# EAGLE design Cool-unitV2 (EAGLE 8.4.2)
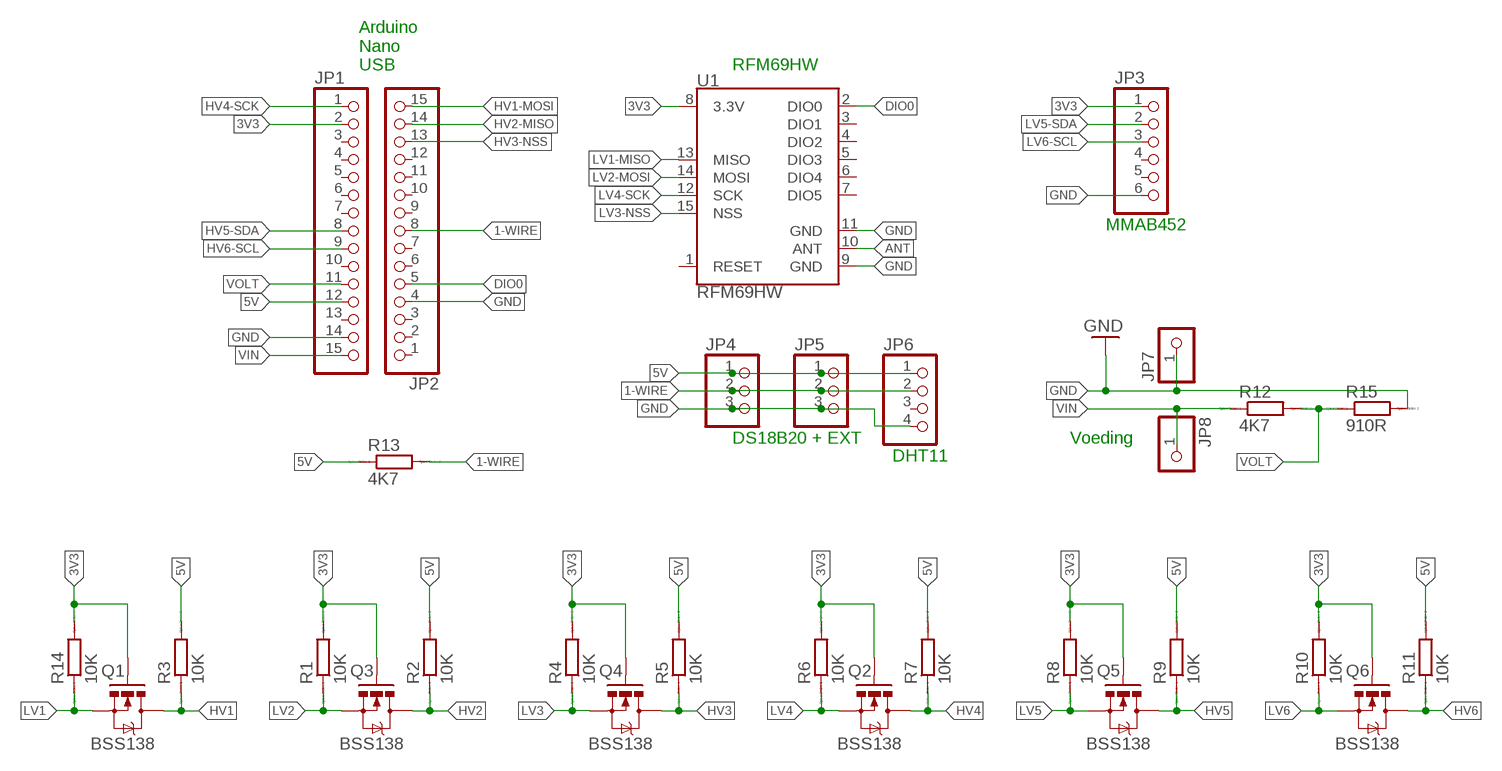
[diagram p0: schematic, sheet 1]

## Parts
JP1  PINHD-1X15  [1X15]
JP2  PINHD-1X15  [1X15]
JP3  PINHD-1X6  [1X06]
JP4  PINHD-1X3  [1X03]
JP5  PINHD-1X3  [1X03]
JP6  PINHD-1X4  [1X04]
JP7  PINHD-1X1  [1X01]
JP8  PINHD-1X1  [1X01]
Q1  BSS138  MOSFET-NCHANNELSMD  [SOT23-3]
Q2  BSS138  MOSFET-NCHANNELSMD  [SOT23-3]
Q3  BSS138  MOSFET-NCHANNELSMD  [SOT23-3]
Q4  BSS138  MOSFET-NCHANNELSMD  [SOT23-3]
Q5  BSS138  MOSFET-NCHANNELSMD  [SOT23-3]
Q6  BSS138  MOSFET-NCHANNELSMD  [SOT23-3]
R1  10K  RR3216  [R3216]
R2  10K  RR3216  [R3216]
R3  10K  RR3216  [R3216]
R4  10K  RR3216  [R3216]
R5  10K  RR3216  [R3216]
R6  10K  RR3216  [R3216]
R7  10K  RR3216  [R3216]
R8  10K  RR3216  [R3216]
R9  10K  RR3216  [R3216]
R10  10K  RR3216  [R3216]
R11  10K  RR3216  [R3216]
R12  4K7  RR3216  [R3216]
R13  4K7  RR3216  [R3216]
R14  10K  RR3216  [R3216]
R15  910R  RR3216  [R3216]
U1  RFM69HW  [RFM69W-XXXS2]

## Nets
1-WIRE: JP2.8 JP4.2 JP5.2 JP6.2 R13.2
3V3: JP1.2 JP3.1 Q1.1(G) Q2.1(G) Q3.1(G) Q4.1(G) Q5.1(G) Q6.1(G) R1.2 R4.2 R6.2 R8.2 R10.2 R14.2 U1.8(3.3V)
5V: JP1.12 JP4.1 JP5.1 JP6.1 R2.2 R3.2 R5.2 R7.2 R9.2 R11.2 R13.1
ANT: U1.10(ANT)
DIO0: JP2.5 U1.2(DIO0)
GND: JP1.14 JP2.4 JP3.6 JP4.3 JP5.3 JP6.4 JP7.1 R15.2 U1.9(GND) U1.11(GND)
HV1: JP2.15 Q1.3(D) R3.1
HV2: JP2.14 Q3.3(D) R2.1
HV3: JP2.13 Q4.3(D) R5.1
HV4: JP1.1 Q2.3(D) R7.1
HV5: JP1.8 Q5.3(D) R9.1
HV6: JP1.9 Q6.3(D) R11.1
LV1: Q1.2(S) R14.1 U1.13(MISO)
LV2: Q3.2(S) R1.1 U1.14(MOSI)
LV3: Q4.2(S) R4.1 U1.15(NSS)
LV4: Q2.2(S) R6.1 U1.12(SCK)
LV5: JP3.2 Q5.2(S) R8.1
LV6: JP3.3 Q6.2(S) R10.1
VIN: JP1.15 JP8.1 R12.1
VOLT: JP1.11 R12.2 R15.1
Unconnected: JP1.3 JP1.4 JP1.5 JP1.6 JP1.7 JP1.10 JP1.13 JP2.1 JP2.2 JP2.3 JP2.6 JP2.7 JP2.9 JP2.10 JP2.11 JP2.12 JP3.4 JP3.5 JP6.3 U1.1(RESET) U1.3(DIO1) U1.4(DIO2) U1.5(DIO3) U1.6(DIO4) U1.7(DIO5)

## Notes on the sheet
- Arduino
  Nano
  USB
- RFM69HW
- MMAB452
- DS18B20 + EXT | Voeding
- DHT11

## Library data of the parts
JP1 JP2 = pinhead:PINHD-1X15: PIN HEADER
JP3 = pinhead:PINHD-1X6: PIN HEADER
JP4 JP5 = pinhead:PINHD-1X3: PIN HEADER
JP6 = pinhead:PINHD-1X4: PIN HEADER
JP7 JP8 = pinhead:PINHD-1X1: PIN HEADER
Q1-Q6 = SparkFun:MOSFET-NCHANNEL
R1-R15 = eagle-ltspice:R: RESISTOR, European symbol; SPICEMODEL: NONE; SPICEPREFIX: R
U1 = SparkFun-RF:RFM69H: Hope RF RFM69H ISM Transceiver Module The RFM69H is a transceiver module capable of operation over a wide frequency range, including the 315,433,868 and 915MHz license-free ISM (Industry Scientific and Medical) frequency bands. All major RF communication parameters are programmable and most of them can be dynamically set. The RFM69H offers the unique advantage of programmable narrow-band and wide- band communication modes. The RFM69H is optimized for low power consumption while offering high RF output power and channelized operation.Compliance ETSI and FCC regulations. Datasheet <http://www.hoperf.cn/upload/docs/RF/SX/RFM69H_DataSheet_v1.3.pdf> SparkFun Products RFM69HCW Wireless Transceiver - 915MHz <https://www.sparkfun.com/products/13909> (COM-13909) RFM69HCW Wireless Transceiver - 434MHz <https://www.sparkfun.com/products/13910> (COM-13910) SparkFun RFM69 Breakout (915MHz) <https://www.sparkfun.com/products/12775> (WRL-12775) SparkFun RFM69 Breakout (434MHz) <https://www.sparkfun.com/products/12823> (WRL-12823)

## Board
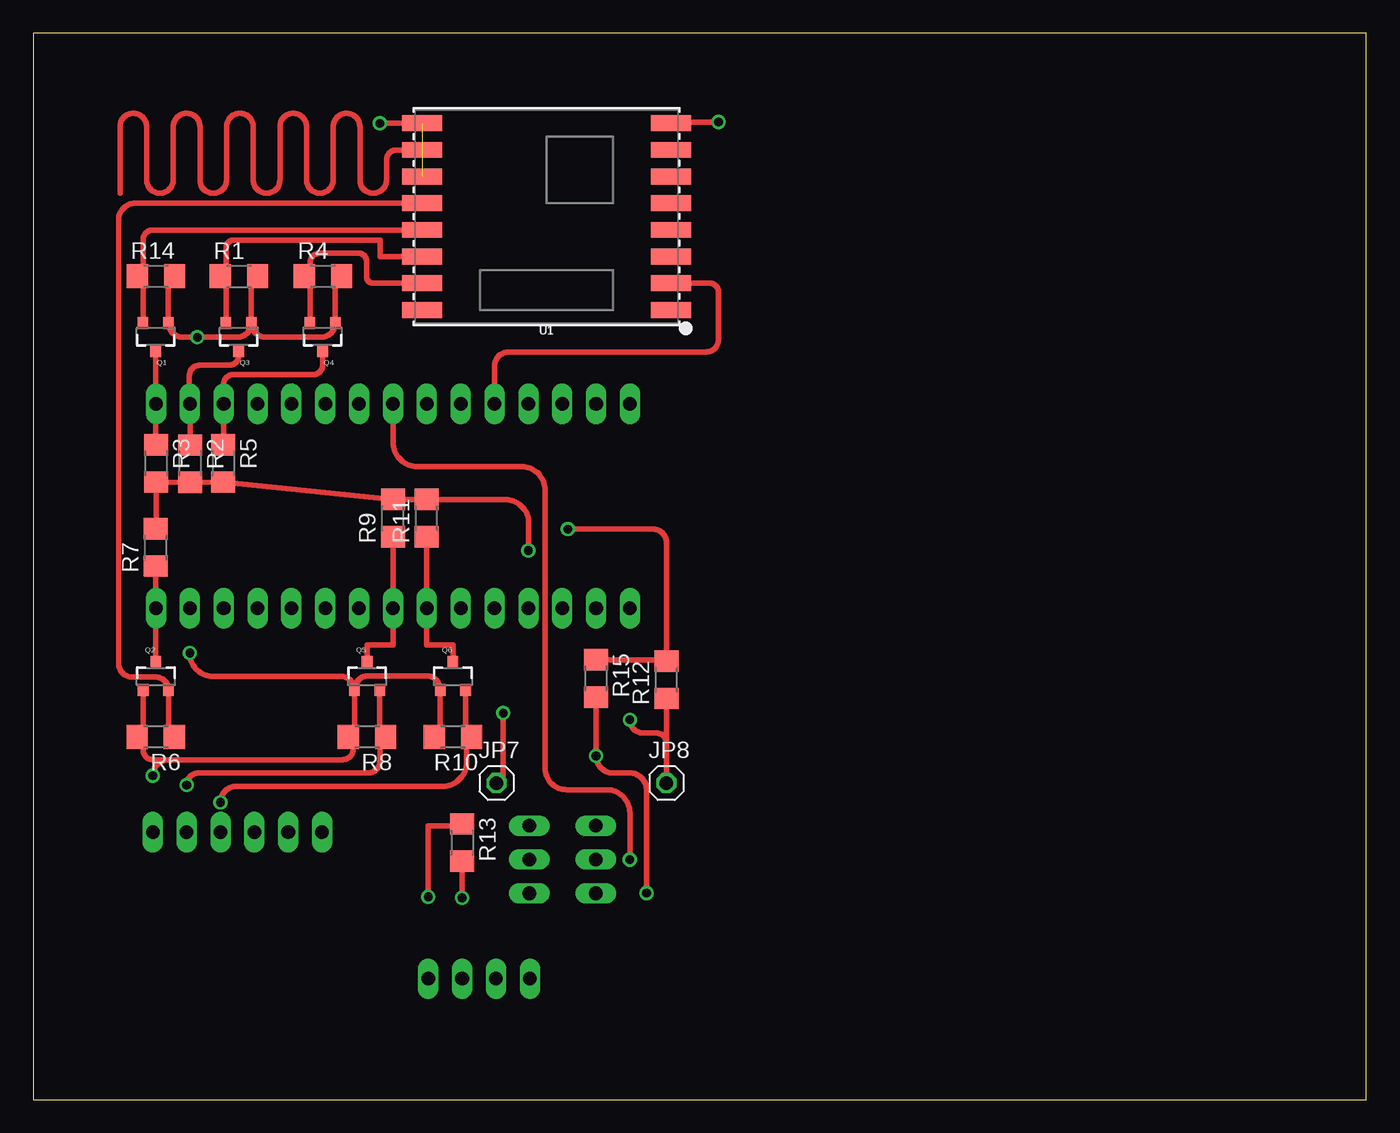
[diagram p1: board, top side]
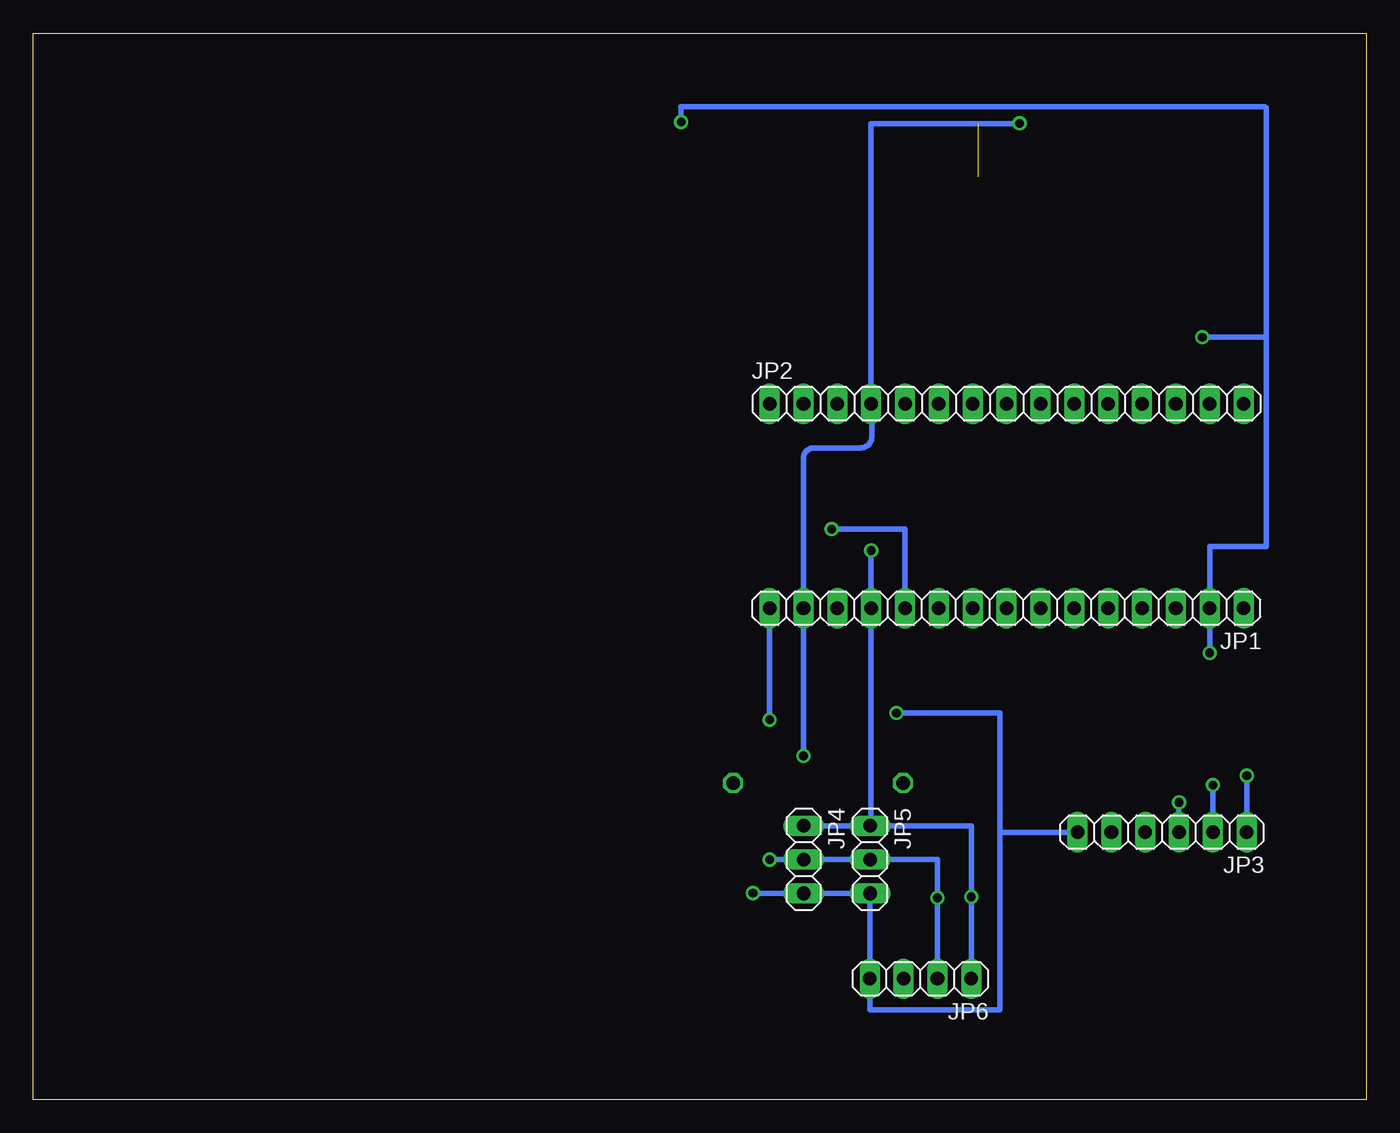
[diagram p2: board, bottom side, seen from below]

Size 100 x 80 mm. Coordinates in mm from the lower left corner, seen from the top.
Outline: 0,0 100,0 100,80 0,80 0,0
Copper layers (1*16): Top 0.035mm / dielectric 1.5mm / Bottom 0.035mm
Design rules "default": minimum track width 10mil, minimum drill 24mil, track to track 8mil, track to pad 8mil, pad to pad 8mil, via to via 8mil, smd to smd 8mil, copper to edge 40mil, drill to drill 8mil, minimum pad ring 10mil, minimum via ring 8mil, stop-mask expansion 4mil, vias tented up to drill 0mil, thermal gap 10mil

### Footprints (pad centres in the part's own frame; a part is rotated, then mirrored left to right if it is on the bottom)
1X15 = drill 1.016 long: 1 -17.78,0; 2 -15.24,0; 3 -12.7,0; 4 -10.16,0; 5 -7.62,0; 6 -5.08,0; 7 -2.54,0; 8 0,0; 9 2.54,0; 10 5.08,0; 11 7.62,0; 12 10.16,0; 13 12.7,0; 14 15.24,0; 15 17.78,0
1X06 = drill 1.016 long: 1 -6.35,0; 2 -3.81,0; 3 -1.27,0; 4 1.27,0; 5 3.81,0; 6 6.35,0
1X03 = drill 1.016 long: 1 -2.54,0; 2 0,0; 3 2.54,0
1X04 = drill 1.016 long: 1 -3.81,0; 2 -1.27,0; 3 1.27,0; 4 3.81,0
1X01 = drill 1.016 octagon: 1 0,0
SOT23-3 = smd 0.8 x 0.9: 1 -0.95,-1; 2 0.95,-1; 3 0,1.1
R3216 = smd 1.6 x 1.8: 1 -1.4,0; 2 1.4,0
RFM69W-XXXS2 = smd 3 x 1.2: 1 -9.35,7; 2 -9.35,5; 3 -9.35,3; 4 -9.35,1; 5 -9.35,-1; 6 -9.35,-3; 7 -9.35,-5; 8 -9.35,-7; 9 9.35,-7; 10 9.35,-5; 11 9.35,-3; 12 9.35,-1; 13 9.35,1; 14 9.35,3; 15 9.35,5; 16 9.35,7

### Placement (x,y rotation side)
JP1  26.98,36.86 180 bottom
JP2  26.98,52.21 0 bottom
JP3  15.31,20.06 180 bottom
JP4  42.2,18.01 270 bottom
JP5  37.22,18.01 270 bottom
JP6  33.44,9.06 180 bottom
JP7  34.75,23.75 0 top
JP8  47.5,23.75 0 top
Q1  9.18,57.26 180 top
Q2  9.2,31.73 0 top
Q3  15.41,57.26 180 top
Q4  21.7,57.26 180 top
Q5  25.04,31.73 0 top
Q6  31.48,31.73 0 top
R1  15.43,61.77 0 top
R2  11.76,47.71 270 top
R3  9.21,47.73 270 top
R4  21.73,61.78 0 top
R5  14.25,47.73 270 top
R6  9.2,27.2 180 top
R7  9.19,41.43 90 top
R8  25.04,27.2 180 top
R9  26.98,43.63 90 top
R10  31.48,27.2 180 top
R11  29.51,43.63 90 top
R12  47.5,31.5 90 top
R13  32.18,19.28 270 top
R14  9.2,61.78 0 top
R15  42.2,31.6 270 top
U1  38.5,66.25 180 top

### Tracks (layer width: path | path; a pad name or v marks a point on that pad's centre or on a via)
1-WIRE  (via drill 0.65)
  Top 0.406: 32.18,18.01 R13.2 v32.18,15.13 v32.17,15.13 | v44.75,18 44.75,21.2 arc90 43.2,23.25 40,23.25 arc-90 38.4,24.85 38.4,45.7 arc90 36.6,47.5 28.8,47.5 arc-90 27,49.3 arc-90 26.98,49.32 JP2.8
  Bottom 0.406: JP6.2 v32.17,15.13 32.17,18.01 JP5.2 JP4.2 v44.75,18.01 v44.75,18
3V3  (via drill 0.65)
  Top 0.406: R14.2 10.13,61.31 Q1.1 arc90 11.19,57.2 v12.3,57.2 15.3,57.2 arc90 Q3.1 | Q3.1 16.36,61.3 R1.2 | R4.2 22.65,61.3 Q4.1 arc-90 21.59,57.2 17.42,57.2 arc-90 Q3.1 | 8.24,27.66 Q2.1 | 8.24,27.66 R6.2 arc-90 7.59,27 7.5,27 | Q5.1 24.09,27.66 R8.2 24,27.2 24,26.3 arc-90 23.2,25.5 10.16,25.5 | R10.2 30.53,27.66 Q6.1 arc90 29.46,31.8 25.16,31.8 arc90 Q5.1 | 10.16,25.5 8.96,25.5 arc-90 8.24,26.21 8.24,27.66 | Q5.1 arc90 23.07,31.75 13.5,31.75 arc-90 v11.74,33.51 | v8.96,24.3 arc-90 10.16,25.5 | U1.8 47.85,73.35 v51.4,73.35
  Bottom 0.406: v8.96,24.3 JP3.1 | JP1.2 | JP1.2 11.74,41.24 11.75,41.25 11.75,41.5 7.5,41.5 7.5,57.25 | 7.5,57.25 7.6,57.2 v12.3,57.2 12.4,57.2 | JP1.2 v11.74,33.51 | 7.5,57.25 7.5,74.4 7.6,74.5 51.4,74.5 v51.4,73.35
5V  (via drill 0.65)
  Top 0.406: R7.2 arc90 9.21,42.85 R3.2 R2.2 R5.2 R9.2 R11.2 35,45.01 35.41,45.01 arc-90 37.17,43.25 v37.14,41.19 | R13.1 32.18,20.55 29.63,20.55 v29.63,15.21
  Bottom 0.406: v37.14,41.19 JP1.12 37.12,36.86 37.12,36.81 arc90 37.14,36.8 37.14,20.55 JP5.1 | JP6.1 v29.63,15.21 29.63,20.55 JP5.1 | JP5.1 JP4.1
ANT
  Top 0.406: 6.5,68 6.5,73 arc-90 7.5,74 arc-90 8.5,73 8.5,69 arc90 9.5,68 arc90 10.5,69 10.5,73 arc-90 11.5,74 arc-90 12.5,73 12.5,69 arc90 13.5,68 arc90 14.5,69 14.5,73 arc-90 15.5,74 arc-90 16.5,73 16.5,69 arc90 17.5,68 arc90 18.5,69 18.5,73 arc-90 19.5,74 arc-90 20.5,73 20.5,69 arc90 21.5,68 arc90 22.5,69 22.5,73 arc-90 23.5,74 arc-90 24.5,73 24.5,69 arc90 25.5,68 arc90 26.5,69 26.5,70.5 arc-90 27.25,71.25 U1.10
DIO0
  Top 0.406: JP2.5 34.6,55 arc-90 35.7,56.1 50.5,56.1 arc90 51.4,57 51.4,60.6 arc90 50.75,61.25 U1.2
GND  (via drill 0.65)  (1 unrouted)
  Top 0.406: 46,16.99 46,23.25 arc90 44.75,24.5 43.5,24.5 arc-90 v42.22,25.78 42.2,25.78 R15.2 | v46,15.49 46,16.99 | 46,16.99 | JP7.1 35.25,24.25 v35.25,29 | v26,73.25 U1.9
  Bottom 0.406: 27.5,20.06 27.5,6.75 37.25,6.75 JP6.4 37.22,9.06 JP5.3 JP4.3 46,15.47 v46,15.49 | JP3.6 27.5,20.06 | v42.22,25.78 JP1.14 42.22,48.1 arc90 41.42,48.9 37.9,48.9 arc-90 37.1,49.7 37.1,52.21 JP2.4 37.14,73.2 26,73.2 v26,73.25 | 27.5,20.06 27.5,29 v35.25,29
HV1
  Top 0.406: R3.1 9.18,49.13 9.18,52.2 | 9.2,56.14 Q1.3 9.18,52.2 | JP2.15 9.18,52.2
HV2
  Top 0.406: 11.74,49.13 R2.1 11.76,52.21 | Q3.3 15.41,55.81 arc-90 14.7,55.1 12.5,55.1 arc90 11.7,54.3 11.7,52.21 11.76,52.21 | JP2.14 11.76,52.21
  Bottom 0.406: JP2.14 11.7,52.21
HV3
  Top 0.406: R5.1 14.28,49.16 JP2.13 14.28,53.68 arc-90 15,54.4 21,54.4 arc90 21.7,55.1 Q4.3
HV4
  Top 0.406: R7.1 | 8.78,40.03 R7.1 | Q2.3 arc-90 Q2.3 JP1.1 | JP1.1 R7.1 | JP1.1
HV5
  Top 0.406: Q5.3 25.04,34.1 27,34.1 27,36.86 JP1.8 R9.1
HV6
  Top 0.406: R11.1 JP1.9 arc90 29.5,36.84 29.5,34.1 31.5,34.1 arc90 31.48,34.08 Q6.3
LV1
  Top 0.406: 8.23,61.35 Q1.2 | 8.23,61.35 R14.1 | 8.23,61.35 8.23,64.5 arc-90 8.98,65.25 U1.13
LV2
  Top 0.406: 14.46,61.33 Q3.2 | 14.46,61.33 R1.1 | 14.46,61.33 14.46,63.9 arc-90 15.06,64.5 26,64.5 26,63.25 U1.14
LV3
  Top 0.406: 20.75,61.36 Q4.2 | 20.75,61.36 R4.1 | 20.75,61.36 20.75,62.75 arc-90 21.5,63.5 24.4,63.5 arc-90 25,62.9 25,61.75 arc90 25.5,61.25 U1.15
LV4
  Top 0.406: R6.1 10.14,27.66 Q2.2 arc90 9.18,31.7 7.4,31.7 arc-90 6.4,32.7 6.4,65.25 6.4,66 arc-90 7.65,67.25 U1.12
LV5  (via drill 0.65)
  Top 0.406: Q5.2 25.99,27.65 R8.1 26,27.2 26,25.4 arc-90 25.1,24.5 12.4,24.5 arc90 v11.5,23.6
  Bottom 0.406: JP3.2 v11.5,23.6
LV6  (via drill 0.65)
  Top 0.406: Q6.2 32.43,27.65 R10.1 32.5,27.2 32.5,25.3 arc-90 30.7,23.5 15.24,23.5 arc90 v14.04,22.3
  Bottom 0.406: JP3.3 v14.04,22.3
VIN  (via drill 0.65)
  Top 0.406: v44.76,28.49 arc90 45.75,27.5 46.75,27.5 arc-90 47.5,26.75 JP8.1 R12.1
  Bottom 0.406: v44.76,28.49 JP1.15
VOLT  (via drill 0.65)
  Top 0.406: R15.1 47.5,33 R12.2 47.5,41.8 arc90 46.5,42.8 v40.1,42.8 | v40.1,42.8 40,42.8 v40.1,42.8
  Bottom 0.406: v40.1,42.8 34.6,42.8 JP1.11